# EAGLE schematic zdroj_schema_1 (EAGLE 7.7.0)
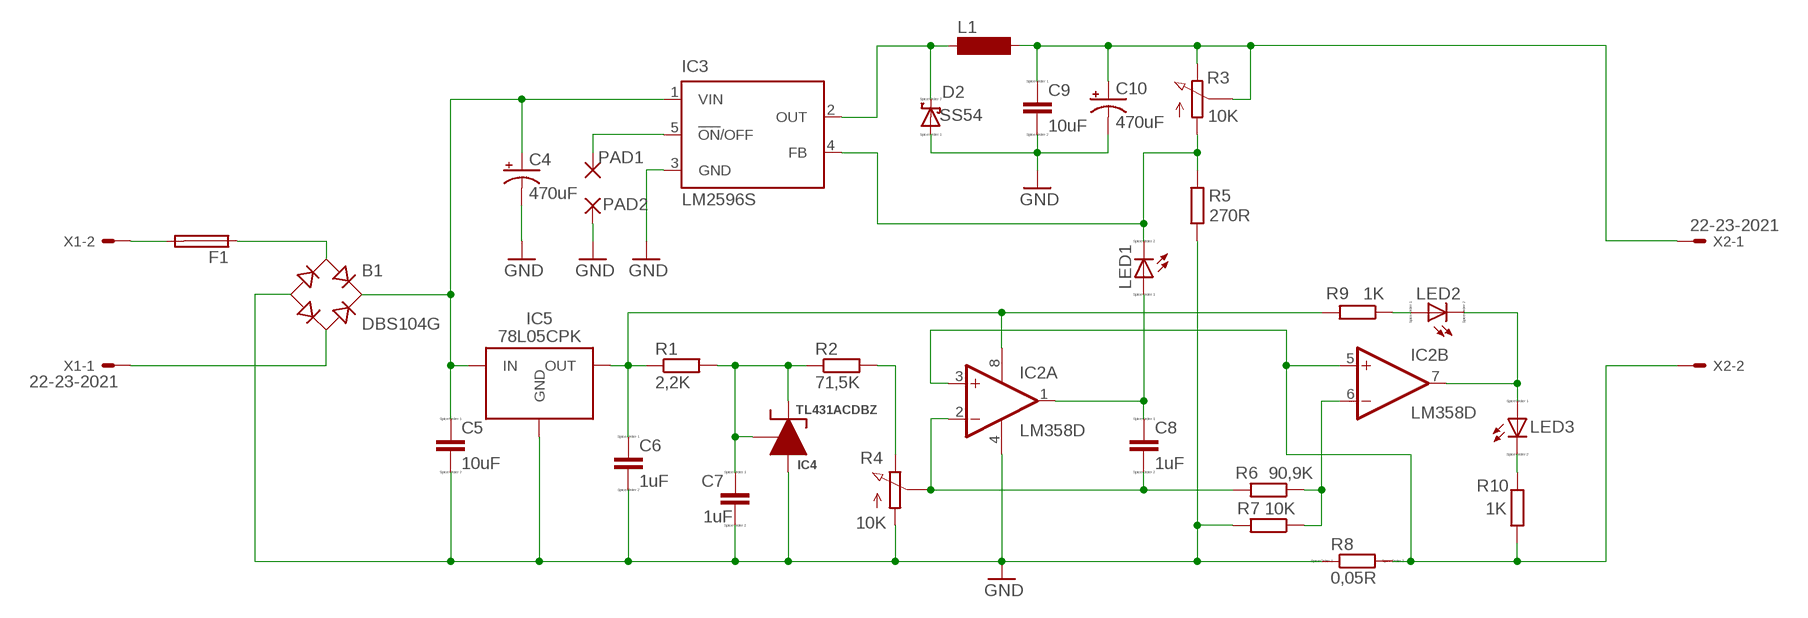
[diagram p0: schematic, sheet 1]

## Parts
B1  DBS104G  [DBS]
C4  470uF  CPOL-US153CLV-0605  [153CLV-0605]
C5  10uF  C  [C0805]
C6  1uF  C  [C0805]
C7  1uF  C  [C0805]
C8  1uF  C  [C0805]
C9  10uF  C  [C0805]
C10  470uF  CPOL-US153CLV-0605  [153CLV-0605]
D2  SS54  SCHOTTKY-DIODE  [DIODE_SMB]
F1  TE5  [TE5]
IC2  LM358D  [SO08]
IC3  LM2596S  [TO263-5]
IC4  TL431ACDBZ  [SOT-23]
IC5  78L05CPK  [SOT89]
L1  SM-L15B  [SM-L15B]
LED1  LED_E  [LED_1206]
LED2  LED_E  [LED_1206]
LED3  LED_E  [LED_1206]
PAD1  2,54/1,0  [2,54/1,0]
PAD2  2,54/1,0  [2,54/1,0]
R1  2,2K  R-EU_M0805  [M0805]
R2  71,5K  R-EU_M0805  [M0805]
R3  10K  PC25  [PC25]
R4  10K  PC25  [PC25]
R5  270R  R-EU_M0805  [M0805]
R6  90,9K  R-EU_M0805  [M0805]
R7  10K  R-EU_M0805  [M0805]
R8  0,05R  RR2512  [R2512]
R9  1K  R-EU_M0805  [M0805]
R10  1K  R-EU_M0805  [M0805]
X1  22-23-2021  [22-23-2021]
X2  22-23-2021  [22-23-2021]

## Nets
GND: B1.- C4.- C5.2 C6.2 C7.2 C9.2 C10.- D2.A(C) IC2.4(P:V-) IC3.3(GND) IC4.3(ANODE) IC5.2(GND) IC5.2@1(GND) PAD2.1(P) R4.A R5.1 R7.2 R8.1
N$1: F1.2 X1.2
N$2: B1.AC1 F1.1
N$3: B1.AC2 X1.1
N$5: C8.1 IC2.1(A:OUT) LED1.A
N$6: B1.+ C4.+ C5.1 IC3.1(VIN) IC5.3(IN)
N$7: C6.1 IC2.8(P:V+) IC5.1(OUT) R1.1 R9.2
N$8: D2.C(A) IC3.2(OUT) L1.1
N$9: C7.1 IC4.1(CATHODE) IC4.2(REF) R1.2 R2.1
N$10: R2.2 R4.E
N$11: C8.2 IC2.2(A:-IN) R4.S R6.2
N$12: C9.1 C10.+ L1.2 R3.E R3.S X2.1
N$13: IC2.6(B:-IN) R6.1 R7.1
N$14: LED2.A R9.1
N$15: IC2.7(B:OUT) LED2.C LED3.A
N$16: LED3.C R10.1
N$17: IC3.4(FB) LED1.C R3.A R5.2
N$18: IC2.3(A:+IN) IC2.5(B:+IN) R8.2 R10.2 X2.2
N$19: IC3.5(!ON!/OFF) PAD1.1(P)

## Library data of the parts
B1 = rectifier:DB?*G: Single Phase 1.0 AMP Glass Passivated Bridge Rectifier Taiwan Semiconductor Co.,Ltd. - TSC Source: http://www.taiwansemi.com/TSCbig5/ezcatfiles/cust/img/img/db101g.pdf http://www.ts.com.tw/db/pictures/modules/PDT/PDT060207001/DBLS201G.pdf
C4 C10 = rcl:CPOL-US: POLARIZED CAPACITOR, American symbol
C5-C9 = eagle-ltspice:C: CAPACITOR, European symbol; SPICEMODEL: NONE; SPICEPREFIX: C
D2 = eagle-ltspice:SCHOTTKY-DIODE: Schottky Diode; SPICEMODEL: NONE; SPICEPREFIX: D; SPICETYPE: diode
F1 = fuse:TE5: FUSE Wickmann; OC_FARNELL: unknown; OC_NEWARK: unknown
IC2 = linear:LM358: OP AMP also LM158; LM258; LM2904 Source: http://cache.national.com/ds/LM/LM158.pdf
IC3 = national-semiconductor:LM2596: SIMPLE SWITCHER® Power Converter 150 kHz 3A Step-Down Voltage Regulator Source: http://www.national.com/ds/LM/LM2596.pdf; MF: NATIONAL SEMICONDUCTOR; MPN: LM2596S-ADJ/NOPB; OC_FARNELL: 9494367; OC_NEWARK: 41K3842
IC4 = TL431:TL431: Precision Shunt Regulator; MF: Texas Instruments; MPN: TL431ACDBZ
IC5 = Regulators:78L05*?; MARK: B5; MF: Texas Instruments; MPN: UA78L05CPK
L1 = inductor-neosid:SM-L15: INDUCTOR SMD air coil with pick and place cap; OC_FARNELL: unknown; OC_NEWARK: unknown
LED1-LED3 = eagle-ltspice:LED_E: LED Source: http://www.osram.convergy.de Source: www.luxeon.com Source: www.kingbright.com; SPICEMODEL: NONE; SPICEPREFIX: D; SPICETYPE: diode
PAD1 PAD2 = wirepad:2,54/1,0: THROUGH-HOLE PAD
R1 R2 R5-R7 R9 R10 = rcl:R-EU_: RESISTOR, European symbol
R3 R4 = pot-vitrohm:PC25: VITROHM POTENTIOMETER; MF: CLAROSTAT; MPN: 308NPC25KS; OC_FARNELL: 1440998; OC_NEWARK: 03F7518
R8 = eagle-ltspice:R: RESISTOR, European symbol; SPICEMODEL: NONE; SPICEPREFIX: R
X1 X2 = con-molex:22-23-2021: .100" (2.54mm) Center Header - 2 Pin; MF: MOLEX; MPN: 22-23-2021; OC_FARNELL: 1462926; OC_NEWARK: 25C3832